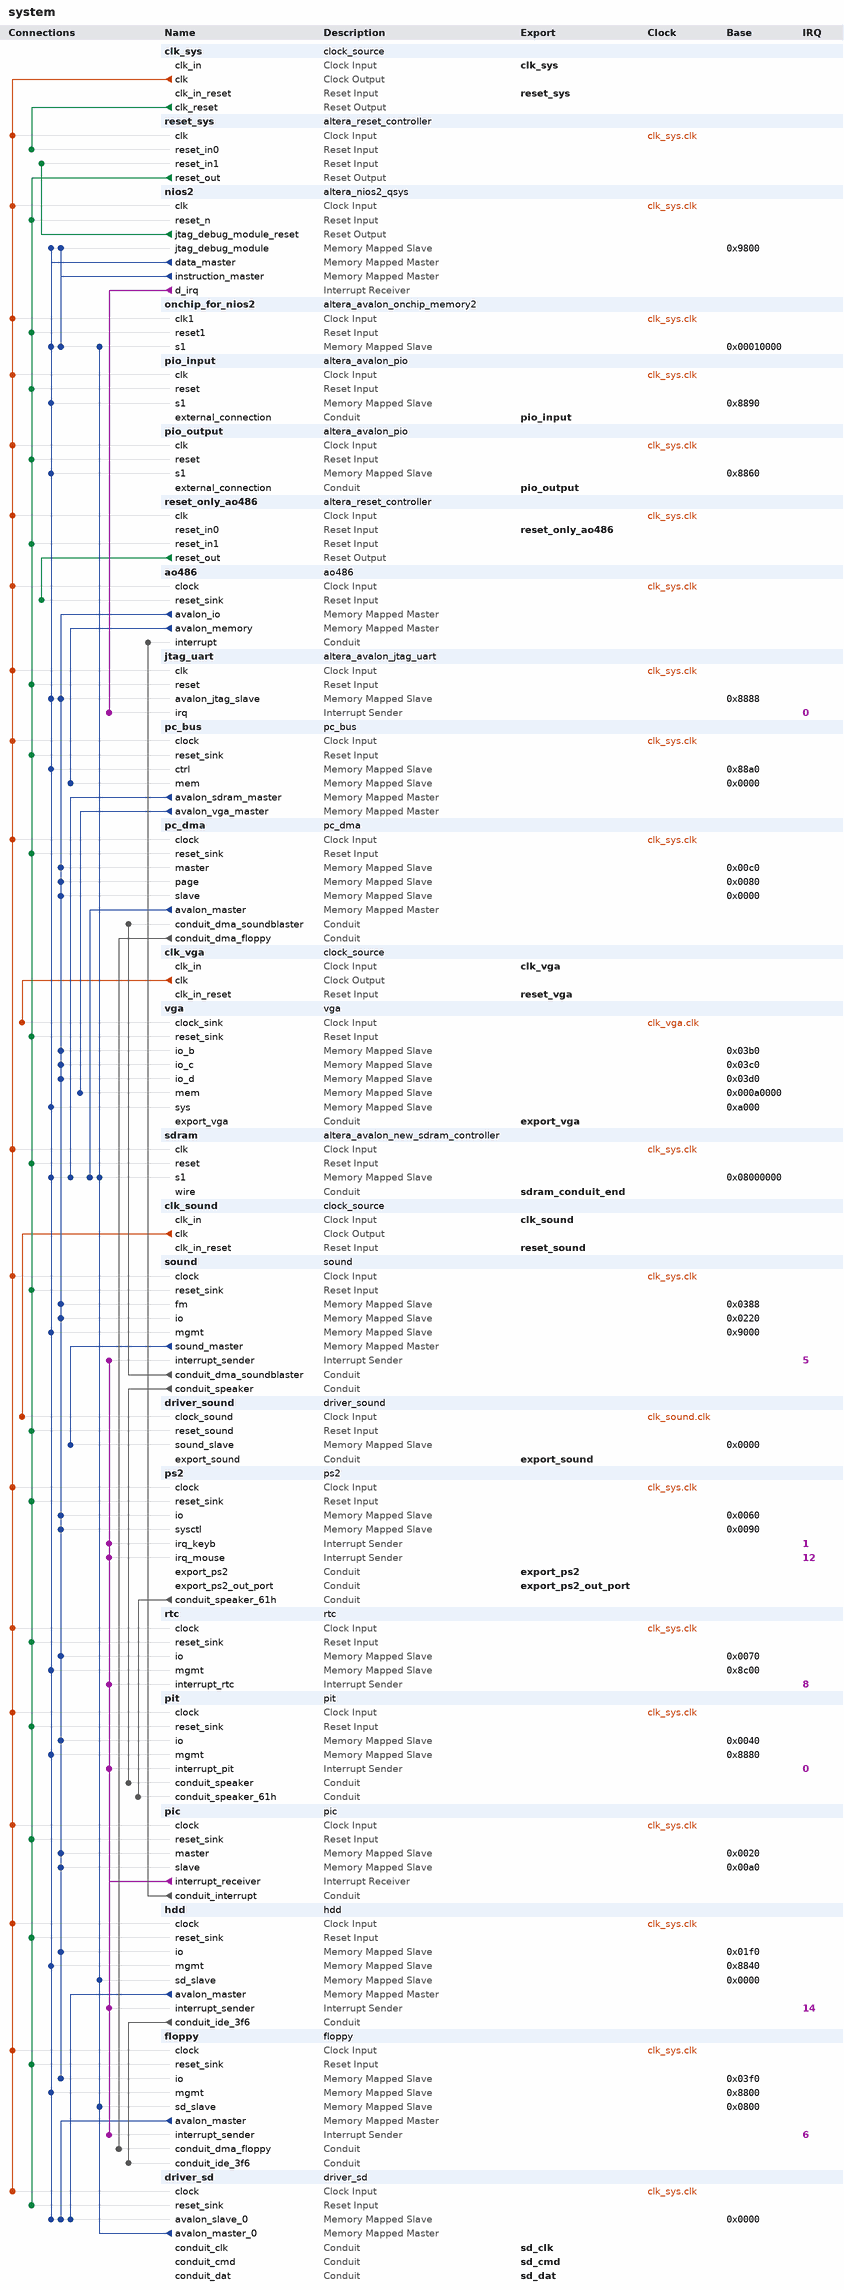
[diagram p0: system contents]
# Platform Designer (Qsys) system system, Cyclone IV E EP4CE115F29C7
# Parameters at their usual value, and those the tool derives, are not listed.
package require -exact qsys 14.0
create_system system
set_project_property DEVICE_FAMILY {Cyclone IV E}
set_project_property DEVICE EP4CE115F29C7

add_instance clk_sys clock_source 14.0
set_instance_parameter_value clk_sys clockFrequency 60000000

add_instance reset_sys altera_reset_controller 14.0
set_instance_parameter_value reset_sys NUM_RESET_INPUTS 2
set_instance_parameter_value reset_sys SYNC_DEPTH 2

add_instance nios2 altera_nios2_qsys 14.0
set_instance_parameter_value nios2 resetrequest_enabled true
set_instance_parameter_value nios2 resetSlave onchip_for_nios2.s1
set_instance_parameter_value nios2 mmu_TLBMissExcSlave None
set_instance_parameter_value nios2 exceptionSlave onchip_for_nios2.s1
set_instance_parameter_value nios2 breakSlave nios2.jtag_debug_module
set_instance_parameter_value nios2 impl Tiny
set_instance_parameter_value nios2 icache_size 4096

add_instance onchip_for_nios2 altera_avalon_onchip_memory2 14.0
set_instance_parameter_value onchip_for_nios2 dataWidth 32
set_instance_parameter_value onchip_for_nios2 dualPort false
set_instance_parameter_value onchip_for_nios2 initMemContent true
set_instance_parameter_value onchip_for_nios2 initializationFileName onchip_mem.hex
set_instance_parameter_value onchip_for_nios2 memorySize 32768

add_instance pio_input altera_avalon_pio 14.0
set_instance_parameter_value pio_input captureEdge true
set_instance_parameter_value pio_input direction Input
set_instance_parameter_value pio_input width 8

add_instance pio_output altera_avalon_pio 14.0
set_instance_parameter_value pio_output direction Output
set_instance_parameter_value pio_output resetValue 255
set_instance_parameter_value pio_output width 8

add_instance reset_only_ao486 altera_reset_controller 14.0
set_instance_parameter_value reset_only_ao486 NUM_RESET_INPUTS 2
set_instance_parameter_value reset_only_ao486 SYNC_DEPTH 2

add_instance ao486 ao486 1.0

add_instance jtag_uart altera_avalon_jtag_uart 14.0
set_instance_parameter_value jtag_uart readBufferDepth 256
set_instance_parameter_value jtag_uart simInteractiveOptions NO_INTERACTIVE_WINDOWS
set_instance_parameter_value jtag_uart writeBufferDepth 256

add_instance pc_bus pc_bus 1.0

add_instance pc_dma pc_dma 1.0

add_instance clk_vga clock_source 14.0
set_instance_parameter_value clk_vga clockFrequency 26000000

add_instance vga vga 1.0

add_instance sdram altera_avalon_new_sdram_controller 14.0
set_instance_parameter_value sdram TAC 5.5
set_instance_parameter_value sdram TRCD 20.0
set_instance_parameter_value sdram TRP 20.0
set_instance_parameter_value sdram casLatency 2
set_instance_parameter_value sdram columnWidth 10
set_instance_parameter_value sdram dataWidth 32
set_instance_parameter_value sdram generateSimulationModel false
set_instance_parameter_value sdram model single_Micron_MT48LC4M32B2_7_chip
set_instance_parameter_value sdram numberOfBanks 4
set_instance_parameter_value sdram numberOfChipSelects 1
set_instance_parameter_value sdram powerUpDelay 100.0
set_instance_parameter_value sdram refreshPeriod 15.625
set_instance_parameter_value sdram rowWidth 13

add_instance clk_sound clock_source 14.0
set_instance_parameter_value clk_sound clockFrequency 12000000

add_instance sound sound 1.0

add_instance driver_sound driver_sound 1.0

add_instance ps2 ps2 1.0

add_instance rtc rtc 1.0

add_instance pit pit 1.0

add_instance pic pic 1.0

add_instance hdd hdd 1.0

add_instance floppy floppy 1.0

add_instance driver_sd driver_sd 2.0

# connections
add_connection clk_sound.clk driver_sound.clock_sound clock
add_connection clk_sys.clk ao486.clock clock
add_connection clk_sys.clk driver_sd.clock clock
add_connection clk_sys.clk floppy.clock clock
add_connection clk_sys.clk hdd.clock clock
add_connection clk_sys.clk jtag_uart.clk clock
add_connection clk_sys.clk nios2.clk clock
add_connection clk_sys.clk onchip_for_nios2.clk1 clock
add_connection clk_sys.clk pc_bus.clock clock
add_connection clk_sys.clk pc_dma.clock clock
add_connection clk_sys.clk pic.clock clock
add_connection clk_sys.clk pio_input.clk clock
add_connection clk_sys.clk pio_output.clk clock
add_connection clk_sys.clk pit.clock clock
add_connection clk_sys.clk ps2.clock clock
add_connection clk_sys.clk reset_only_ao486.clk clock
add_connection clk_sys.clk reset_sys.clk clock
add_connection clk_sys.clk rtc.clock clock
add_connection clk_sys.clk sdram.clk clock
add_connection clk_sys.clk sound.clock clock
add_connection clk_vga.clk vga.clock_sink clock
add_connection clk_sys.clk_reset reset_sys.reset_in0 reset
add_connection nios2.jtag_debug_module_reset reset_sys.reset_in1 reset
add_connection reset_only_ao486.reset_out ao486.reset_sink reset
add_connection reset_sys.reset_out driver_sd.reset_sink reset
add_connection reset_sys.reset_out driver_sound.reset_sound reset
add_connection reset_sys.reset_out floppy.reset_sink reset
add_connection reset_sys.reset_out hdd.reset_sink reset
add_connection reset_sys.reset_out jtag_uart.reset reset
add_connection reset_sys.reset_out nios2.reset_n reset
add_connection reset_sys.reset_out onchip_for_nios2.reset1 reset
add_connection reset_sys.reset_out pc_bus.reset_sink reset
add_connection reset_sys.reset_out pc_dma.reset_sink reset
add_connection reset_sys.reset_out pic.reset_sink reset
add_connection reset_sys.reset_out pio_input.reset reset
add_connection reset_sys.reset_out pio_output.reset reset
add_connection reset_sys.reset_out pit.reset_sink reset
add_connection reset_sys.reset_out ps2.reset_sink reset
add_connection reset_sys.reset_out reset_only_ao486.reset_in1 reset
add_connection reset_sys.reset_out rtc.reset_sink reset
add_connection reset_sys.reset_out sdram.reset reset
add_connection reset_sys.reset_out sound.reset_sink reset
add_connection reset_sys.reset_out vga.reset_sink reset
add_connection ao486.avalon_io floppy.io avalon
set_connection_parameter_value ao486.avalon_io/floppy.io baseAddress 0x03f0
add_connection ao486.avalon_io hdd.io avalon
set_connection_parameter_value ao486.avalon_io/hdd.io baseAddress 0x01f0
add_connection ao486.avalon_io jtag_uart.avalon_jtag_slave avalon
set_connection_parameter_value ao486.avalon_io/jtag_uart.avalon_jtag_slave baseAddress 0x8888
add_connection ao486.avalon_io pc_dma.master avalon
set_connection_parameter_value ao486.avalon_io/pc_dma.master baseAddress 0x00c0
add_connection ao486.avalon_io pc_dma.page avalon
set_connection_parameter_value ao486.avalon_io/pc_dma.page baseAddress 0x0080
add_connection ao486.avalon_io pc_dma.slave avalon
set_connection_parameter_value ao486.avalon_io/pc_dma.slave baseAddress 0x0000
add_connection ao486.avalon_io pic.master avalon
set_connection_parameter_value ao486.avalon_io/pic.master baseAddress 0x0020
add_connection ao486.avalon_io pic.slave avalon
set_connection_parameter_value ao486.avalon_io/pic.slave baseAddress 0x00a0
add_connection ao486.avalon_io pit.io avalon
set_connection_parameter_value ao486.avalon_io/pit.io baseAddress 0x0040
add_connection ao486.avalon_io ps2.io avalon
set_connection_parameter_value ao486.avalon_io/ps2.io baseAddress 0x0060
add_connection ao486.avalon_io ps2.sysctl avalon
set_connection_parameter_value ao486.avalon_io/ps2.sysctl baseAddress 0x0090
add_connection ao486.avalon_io rtc.io avalon
set_connection_parameter_value ao486.avalon_io/rtc.io baseAddress 0x0070
add_connection ao486.avalon_io sound.fm avalon
set_connection_parameter_value ao486.avalon_io/sound.fm baseAddress 0x0388
add_connection ao486.avalon_io sound.io avalon
set_connection_parameter_value ao486.avalon_io/sound.io baseAddress 0x0220
add_connection ao486.avalon_io vga.io_b avalon
set_connection_parameter_value ao486.avalon_io/vga.io_b baseAddress 0x03b0
add_connection ao486.avalon_io vga.io_c avalon
set_connection_parameter_value ao486.avalon_io/vga.io_c baseAddress 0x03c0
add_connection ao486.avalon_io vga.io_d avalon
set_connection_parameter_value ao486.avalon_io/vga.io_d baseAddress 0x03d0
add_connection ao486.avalon_memory pc_bus.mem avalon
set_connection_parameter_value ao486.avalon_memory/pc_bus.mem baseAddress 0x0000
add_connection driver_sd.avalon_master_0 floppy.sd_slave avalon
set_connection_parameter_value driver_sd.avalon_master_0/floppy.sd_slave baseAddress 0x0800
add_connection driver_sd.avalon_master_0 hdd.sd_slave avalon
set_connection_parameter_value driver_sd.avalon_master_0/hdd.sd_slave baseAddress 0x0000
add_connection driver_sd.avalon_master_0 onchip_for_nios2.s1 avalon
set_connection_parameter_value driver_sd.avalon_master_0/onchip_for_nios2.s1 baseAddress 0x00010000
add_connection driver_sd.avalon_master_0 sdram.s1 avalon
set_connection_parameter_value driver_sd.avalon_master_0/sdram.s1 baseAddress 0x08000000
add_connection floppy.avalon_master driver_sd.avalon_slave_0 avalon
set_connection_parameter_value floppy.avalon_master/driver_sd.avalon_slave_0 baseAddress 0x0000
add_connection hdd.avalon_master driver_sd.avalon_slave_0 avalon
set_connection_parameter_value hdd.avalon_master/driver_sd.avalon_slave_0 baseAddress 0x0000
add_connection nios2.data_master driver_sd.avalon_slave_0 avalon
set_connection_parameter_value nios2.data_master/driver_sd.avalon_slave_0 baseAddress 0x0000
add_connection nios2.data_master floppy.mgmt avalon
set_connection_parameter_value nios2.data_master/floppy.mgmt baseAddress 0x8800
add_connection nios2.data_master hdd.mgmt avalon
set_connection_parameter_value nios2.data_master/hdd.mgmt baseAddress 0x8840
add_connection nios2.data_master jtag_uart.avalon_jtag_slave avalon
set_connection_parameter_value nios2.data_master/jtag_uart.avalon_jtag_slave baseAddress 0x8888
add_connection nios2.data_master nios2.jtag_debug_module avalon
set_connection_parameter_value nios2.data_master/nios2.jtag_debug_module baseAddress 0x9800
add_connection nios2.data_master onchip_for_nios2.s1 avalon
set_connection_parameter_value nios2.data_master/onchip_for_nios2.s1 baseAddress 0x00010000
add_connection nios2.data_master pc_bus.ctrl avalon
set_connection_parameter_value nios2.data_master/pc_bus.ctrl baseAddress 0x88a0
add_connection nios2.data_master pio_input.s1 avalon
set_connection_parameter_value nios2.data_master/pio_input.s1 baseAddress 0x8890
add_connection nios2.data_master pio_output.s1 avalon
set_connection_parameter_value nios2.data_master/pio_output.s1 baseAddress 0x8860
add_connection nios2.data_master pit.mgmt avalon
set_connection_parameter_value nios2.data_master/pit.mgmt baseAddress 0x8880
add_connection nios2.data_master rtc.mgmt avalon
set_connection_parameter_value nios2.data_master/rtc.mgmt baseAddress 0x8c00
add_connection nios2.data_master sdram.s1 avalon
set_connection_parameter_value nios2.data_master/sdram.s1 baseAddress 0x08000000
add_connection nios2.data_master sound.mgmt avalon
set_connection_parameter_value nios2.data_master/sound.mgmt baseAddress 0x9000
add_connection nios2.data_master vga.sys avalon
set_connection_parameter_value nios2.data_master/vga.sys baseAddress 0xa000
add_connection nios2.instruction_master nios2.jtag_debug_module avalon
set_connection_parameter_value nios2.instruction_master/nios2.jtag_debug_module baseAddress 0x9800
add_connection nios2.instruction_master onchip_for_nios2.s1 avalon
set_connection_parameter_value nios2.instruction_master/onchip_for_nios2.s1 baseAddress 0x00010000
add_connection pc_bus.avalon_sdram_master sdram.s1 avalon
set_connection_parameter_value pc_bus.avalon_sdram_master/sdram.s1 baseAddress 0x08000000
add_connection pc_bus.avalon_vga_master vga.mem avalon
set_connection_parameter_value pc_bus.avalon_vga_master/vga.mem baseAddress 0x000a0000
add_connection pc_dma.avalon_master sdram.s1 avalon
set_connection_parameter_value pc_dma.avalon_master/sdram.s1 baseAddress 0x08000000
add_connection sound.sound_master driver_sound.sound_slave avalon
set_connection_parameter_value sound.sound_master/driver_sound.sound_slave baseAddress 0x0000
add_connection hdd.conduit_ide_3f6 floppy.conduit_ide_3f6 conduit
add_connection pc_dma.conduit_dma_floppy floppy.conduit_dma_floppy conduit
add_connection pic.conduit_interrupt ao486.interrupt conduit
add_connection ps2.conduit_speaker_61h pit.conduit_speaker_61h conduit
add_connection sound.conduit_dma_soundblaster pc_dma.conduit_dma_soundblaster conduit
add_connection sound.conduit_speaker pit.conduit_speaker conduit
add_connection nios2.d_irq jtag_uart.irq interrupt
set_connection_parameter_value nios2.d_irq/jtag_uart.irq irqNumber 0
add_connection pic.interrupt_receiver floppy.interrupt_sender interrupt
set_connection_parameter_value pic.interrupt_receiver/floppy.interrupt_sender irqNumber 6
add_connection pic.interrupt_receiver hdd.interrupt_sender interrupt
set_connection_parameter_value pic.interrupt_receiver/hdd.interrupt_sender irqNumber 14
add_connection pic.interrupt_receiver pit.interrupt_pit interrupt
set_connection_parameter_value pic.interrupt_receiver/pit.interrupt_pit irqNumber 0
add_connection pic.interrupt_receiver ps2.irq_keyb interrupt
set_connection_parameter_value pic.interrupt_receiver/ps2.irq_keyb irqNumber 1
add_connection pic.interrupt_receiver ps2.irq_mouse interrupt
set_connection_parameter_value pic.interrupt_receiver/ps2.irq_mouse irqNumber 12
add_connection pic.interrupt_receiver rtc.interrupt_rtc interrupt
set_connection_parameter_value pic.interrupt_receiver/rtc.interrupt_rtc irqNumber 8
add_connection pic.interrupt_receiver sound.interrupt_sender interrupt
set_connection_parameter_value pic.interrupt_receiver/sound.interrupt_sender irqNumber 5

# exported interfaces
add_interface clk_sys clock sink
set_interface_property clk_sys EXPORT_OF clk_sys.clk_in
add_interface reset_sys reset sink
set_interface_property reset_sys EXPORT_OF clk_sys.clk_in_reset
add_interface clk_vga clock sink
set_interface_property clk_vga EXPORT_OF clk_vga.clk_in
add_interface reset_vga reset sink
set_interface_property reset_vga EXPORT_OF clk_vga.clk_in_reset
add_interface sdram_conduit_end conduit end
set_interface_property sdram_conduit_end EXPORT_OF sdram.wire
add_interface clk_sound clock sink
set_interface_property clk_sound EXPORT_OF clk_sound.clk_in
add_interface reset_sound reset sink
set_interface_property reset_sound EXPORT_OF clk_sound.clk_in_reset
add_interface pio_input conduit end
set_interface_property pio_input EXPORT_OF pio_input.external_connection
add_interface reset_only_ao486 reset sink
set_interface_property reset_only_ao486 EXPORT_OF reset_only_ao486.reset_in0
add_interface pio_output conduit end
set_interface_property pio_output EXPORT_OF pio_output.external_connection
add_interface export_sound conduit end
set_interface_property export_sound EXPORT_OF driver_sound.export_sound
add_interface export_vga conduit end
set_interface_property export_vga EXPORT_OF vga.export_vga
add_interface export_ps2 conduit end
set_interface_property export_ps2 EXPORT_OF ps2.export_ps2
add_interface export_ps2_out_port conduit end
set_interface_property export_ps2_out_port EXPORT_OF ps2.export_ps2_out_port
add_interface sd_dat conduit end
set_interface_property sd_dat EXPORT_OF driver_sd.conduit_dat
add_interface sd_cmd conduit end
set_interface_property sd_cmd EXPORT_OF driver_sd.conduit_cmd
add_interface sd_clk conduit end
set_interface_property sd_clk EXPORT_OF driver_sd.conduit_clk

set_interconnect_requirement {$system} qsys_mm.clockCrossingAdapter HANDSHAKE
set_interconnect_requirement {$system} qsys_mm.maxAdditionalLatency 1

save_system system.qsys
